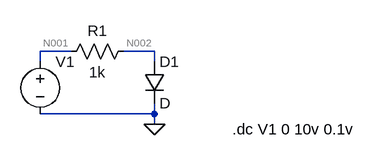
[diagram p0: schematic diode_forward_drop.asc]
diode_forward_drop.asc, the LTspice schematic file:
Version 4
SHEET 1 880 680
WIRE 48 144 0 144
WIRE 176 144 128 144
WIRE 0 160 0 144
WIRE 176 160 176 144
WIRE 176 240 176 224
WIRE 176 240 0 240
WIRE 176 256 176 240
FLAG 176 256 0
SYMBOL diode 160 160 R0
SYMATTR InstName D1
SYMBOL res 144 128 R90
WINDOW 0 0 56 VBottom 2
WINDOW 3 32 56 VTop 2
SYMATTR InstName R1
SYMATTR Value 1k
SYMBOL voltage 0 144 R0
WINDOW 123 0 0 Left 2
WINDOW 39 0 0 Left 2
SYMATTR InstName V1
SYMATTR Value ""
TEXT 296 264 Left 2 !.dc V1 0 10v 0.1v

The netlist it stands for:
* diode_forward_drop.asc
D1 N002 0 D
R1 N002 N001 1k
V1 N001 0
.model D D
.lib standard.dio
.dc V1 0 10v 0.1v
.backanno
.end

* Results of the author's LTspice run, read from the files saved beside the schematic
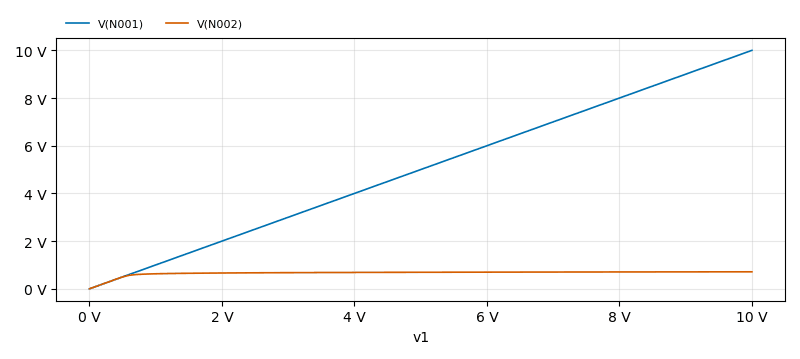
[diagram p1: DC transfer characteristic of diode_forward_drop.asc, plotted from the saved traces]
* DC transfer characteristic, 1 run:
*   V(N001): 0 V at v1=0 V, 10 V at v1=10 V, min 0 V, max 10 V
*   V(N002): 0 V at v1=0 V, 712.8 mV at v1=10 V, min 0 V, max 712.8 mV